# Altium schematic sheet Connector.SchDoc
size A4; SheetNumber: 1; SheetTotal: 1
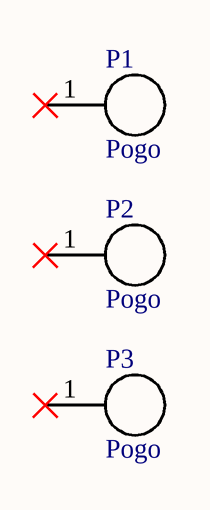
[diagram p0: Connector.SchDoc]

## Parts
P1  Pogo  [POGO]
P2  Pogo  [POGO]
P3  Pogo  [POGO]

## Nets

Not connected (* = marked no-connect by the designer): P1 1*; P2 1*; P3 1*